# Altium schematic sheet Keypad Schematic.SchDoc: Keypad Schematic
size A4; Organization: Altium Limited; Address1: L3, 12a Rodborough Rd; Address2: Frenchs Forest; Address3: NSW; Address4: Australia 2086; DocumentNumber: 1; Revision: V1.0; SheetNumber: 1; SheetTotal: 1
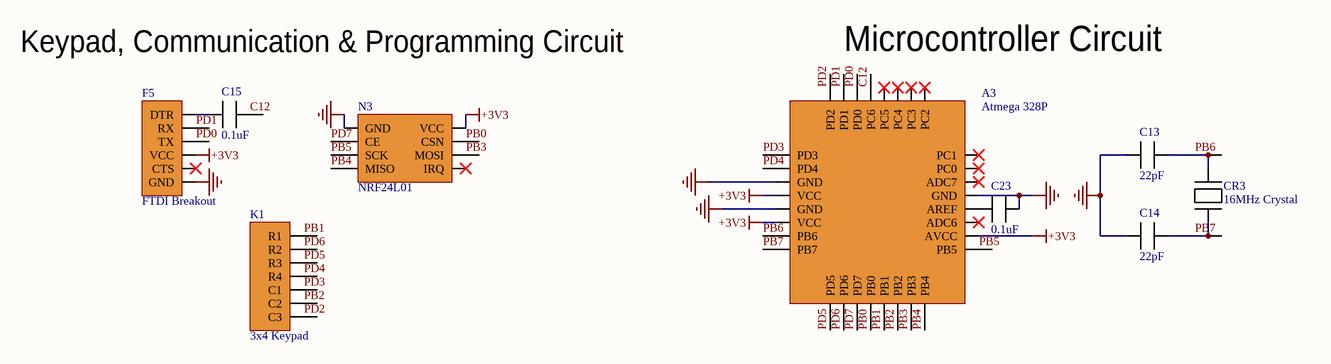
[diagram p0: Keypad Schematic.SchDoc]

## Parts
A3  Atmega 328P  [ATMega328P]
C13  22pF  [22pF Capacitor]
C14  22pF  [22pF Capacitor]
C15  0.1uF  [0.1uF Capacitor]
C23  0.1uF  [0.1uF Capacitor]
CR3  16MHz Crystal  [16MHz Crystal]
F5  FTDI Breakout  [FTDI]
K1  3x4 Keypad  [3x4 Keypad]
N3  NRF24L01  [NRF24L01]

## Nets
+3V3: A3.4(VCC) A3.6(VCC) A3.18(AVCC) F5.4(VCC) N3.5(VCC)
GND: A3.3(GND) A3.5(GND) A3.21(GND) C13.1 C14.1 C23.2 F5.6(GND) N3.1(GND)
C12: A3.29(PC6) C15.2
PB0: A3.12(PB0) N3.6(CSN)
PB1: A3.13(PB1) K1.1(R1)
PB2: A3.14(PB2) K1.6(C2)
PB3: A3.15(PB3) N3.7(MOSI)
PB4: A3.16(PB4) N3.4(MISO)
PB5: A3.17(PB5) N3.3(SCK)
PB6: A3.7(PB6) C13.2 CR3.2
PB7: A3.8(PB7) C14.2 CR3.1
PD0: A3.30(PD0) F5.3(TX)
PD1: A3.31(PD1) F5.2(RX)
PD2: A3.32(PD2) K1.7(C3)
PD3: A3.1(PD3) K1.5(C1)
PD4: A3.2(PD4) K1.4(R4)
PD5: A3.9(PD5) K1.3(R3)
PD6: A3.10(PD6) K1.2(R2)
PD7: A3.11(PD7) N3.2(CE)
NetA3_20: A3.20(AREF) C23.1
NetC15_1: C15.1 F5.1(DTR)

Not connected (* = marked no-connect by the designer): A3 19(ADC6)* 22(ADC7)* 23(PC0)* 24(PC1)* 25(PC2)* 26(PC3)* 27(PC4)* 28(PC5)*; F5 5(CTS)*; N3 8(IRQ)*

## Notes on the sheet
- Keypad, Communication & Programming Circuit
- (near A3) Microcontroller Circuit
- Title
- Size:
- Date:
- A4
- Number:
- Time:
- Revision:
- Sheet
- of
- File:

## Library data of the parts
A3 = ATMEGA328PB-AUR: IC MCU 8BIT 32KB FLASH 32TQFP; Manufacturer: Microchip; Interface: I2C,SPI,UART,USART; Peripherals: Brown-out Detect/Reset,POR,PWM,WDT; Core Architecture: AVR; Frequency: 20MHz; Number of I/Os: 27; Oscillator Type: Internal; Supplier 1: Digi-Key; Manufacturer Part Number: ATMEGA328PB-AUR; RoHS: No; Category: Microcontrollers; Stock 1: 9971; Pricing 1: 1=1.42000, 25=1.30000, 100=1.18000 (USD); Case/Package: TQFP; Number of Pins: 32; Min Operating Temperature: -40°C; Max Operating Temperature: 85°C; Memory Type: FLASH; Packaging: Tape and Reel; Memory Size: 32KB; ComponentLink1URL: http://www.microchip.com/mymicrochip/filehandler.aspx?ddocname=en589666&src-supplier=Digi-Key; ComponentLink1Description: http://www.microchip.com/mymicrochip/filehandler.aspx?ddocname=en589666&src-supplier=Digi-Key; Supplier Part Number 1: ATMEGA328PB-AURCT-ND
C13 C14 = 06035A220JAT2A: Cap Ceramic 22pF 50V C0G 5% SMD 0603 125C Paper T/R; Manufacturer: Kyocera AVX; Insulation Resistance: 100GR; Temperature Coefficient: 30ppm/°C; Supplier 1: Digi-Key; Manufacturer Part Number: 06035A220JAT2A; RoHS: Yes; Category: Ceramic Capacitors; Stock 1: 678111; Pricing 1: 1=0.10000, 10=0.05600, 50=0.03040, 100=0.02480, 500=0.01772, 1000=0.01392 (USD); Mount: Surface Mount,PCB; Case/Package: 0603; Number of Pins: 2; Case Code (Imperial): 0603; Case Code (Metric): 1608; Contact Plating: Tin,Matte; Dielectric Material: Ceramic; Min Operating Temperature: -55°C; Max Operating Temperature: 125°C; Tolerance: 5%; Capacitance: 22pF; Voltage Rating (DC): 50V; Packaging: Tape and Reel; Dielectric: C0G; Voltage: 50V; Voltage Rating: 50V; Package Quantity: 1; Termination: SMD/SMT; Length: 1.6mm; Width: 0.81mm; Height: 0.63mm; Thickness: 0.035inch; Depth: 0.81mm; Radiation Hardening: No; REACH SVHC: No SVHC; Lead Free: Lead Free; ComponentLink1URL: https://datasheet.ciiva.com/11788/0900766b802d4697-11788031.pdf?src-supplier=RSComponents; ComponentLink1Description: https://datasheet.ciiva.com/11788/0900766b802d4697-11788031.pdf?src-supplier=RSComponents; ComponentLink2URL: https://datasheet.ciiva.com/16351/ccog-16351125.pdf?src-supplier=Future+Electronics; ComponentLink2Description: https://datasheet.ciiva.com/16351/ccog-16351125.pdf?src-supplier=Future+Electronics; ComponentLink3URL: https://datasheet.ciiva.com/1124/759117-1124728.pdf?src-supplier=Element14; ComponentLink3Description: https://datasheet.ciiva.com/1124/759117-1124728.pdf?src-supplier=Element14; ComponentLink4URL: https://datasheet.ciiva.com/7855/759117-7855064.pdf?src-supplier=Element14; ComponentLink4Description: https://datasheet.ciiva.com/7855/759117-7855064.pdf?src-supplier=Element14; ComponentLink5URL: https://datasheet.ciiva.com/150/ccog-150366.pdf?src-supplier=Digi-Key; ComponentLink5Description: https://datasheet.ciiva.com/150/ccog-150366.pdf?src-supplier=Digi-Key; ComponentLink6URL: https://datasheet.ciiva.com/150/ccog-150367.pdf?src-supplier=Digi-Key; ComponentLink6Description: https://datasheet.ciiva.com/150/ccog-150367.pdf?src-supplier=Digi-Key; Supplier Part Number 1: 478-1167-1-ND
C15 C23 = 06033C104KAT4A: CAP CER 0.1UF 25V X7R 0603; Manufacturer: Kyocera AVX; Capacitance: 100nF; Tolerance: 10%; Supplier 1: Digi-Key; Manufacturer Part Number: 06033C104KAT4A; RoHS: Yes; Category: Ceramic Capacitors; Stock 1: 6112957; Pricing 1: 1=0.10000, 10=0.04200, 50=0.02320, 100=0.01890, 500=0.01348, 1000=0.01059, 2500=0.00962, 5000=0.00886 (USD); Mount: Surface Mount; Case/Package: 0603; Number of Pins: 2; Case Code (Metric): 1608; Case Code (Imperial): 0603; Min Operating Temperature: -55°C; Max Operating Temperature: 125°C; Packaging: Tape and Reel; Voltage Rating (DC): 25V; Dielectric: X7R; Package Quantity: 1; Voltage Rating: 25V; Termination: SMD/SMT; Length: 1.6mm; Width: 0.032inch; Height: 0.9mm; Thickness: 0.035inch; Depth: 0.81mm; REACH SVHC: No SVHC; Lead Free: Lead Free; ComponentLink1URL: https://datasheet.ciiva.com/22619/1679506-22619862.pdf?src-supplier=Element14; ComponentLink1Description: https://datasheet.ciiva.com/22619/1679506-22619862.pdf?src-supplier=Element14; ComponentLink2URL: https://datasheet.ciiva.com/28613/1679506-28613035.pdf?src-supplier=Element14; ComponentLink2Description: https://datasheet.ciiva.com/28613/1679506-28613035.pdf?src-supplier=Element14; ComponentLink3URL: https://datasheet.ciiva.com/6277/cx7r-6277758.pdf?src-supplier=Digi-Key; ComponentLink3Description: https://datasheet.ciiva.com/6277/cx7r-6277758.pdf?src-supplier=Digi-Key; ComponentLink4URL: https://datasheet.ciiva.com/6277/cx7r-6277759.pdf?src-supplier=Digi-Key; ComponentLink4Description: https://datasheet.ciiva.com/6277/cx7r-6277759.pdf?src-supplier=Digi-Key; Supplier Part Number 1: 478-7018-1-ND
CR3 = ECS-160-20-3X-TR: CRYSTAL 16.0000MHZ 20PF SMD; Manufacturer: ECS International; Frequency Tolerance: 30ppm; ESR (Equivalent Series Resistance): 50R; Frequency Stability: 50ppm; Supplier 1: Digi-Key; Manufacturer Part Number: ECS-160-20-3X-TR; RoHS: Yes; Category: Crystals; Stock 1: 6685; Pricing 1: 1=0.35000, 10=0.28800, 50=0.25880, 100=0.23000, 500=0.21850, 1000=0.18400 (USD); Mount: Surface Mount; Min Operating Temperature: -10°C; Max Operating Temperature: 70°C; Package Quantity: 1; Frequency: 16MHz; Load Capacitance: 20pF; Packaging: Tape and Reel; Tolerance: 30ppm; Termination: SMD/SMT; Length: 0.276inch; Width: 0.161inch; Height: 0.091inch; Lead Free: Lead Free; ComponentLink1URL: https://datasheet.ciiva.com/852/csm-3x-852328.pdf?src-supplier=Digi-Key; ComponentLink1Description: https://datasheet.ciiva.com/852/csm-3x-852328.pdf?src-supplier=Digi-Key; ComponentLink2URL: https://datasheet.ciiva.com/852/csm-3x-852329.pdf?src-supplier=Digi-Key; ComponentLink2Description: https://datasheet.ciiva.com/852/csm-3x-852329.pdf?src-supplier=Digi-Key; ComponentLink3URL: https://datasheet.ciiva.com/852/csm-3x-852330.pdf?src-supplier=Digi-Key; ComponentLink3Description: https://datasheet.ciiva.com/852/csm-3x-852330.pdf?src-supplier=Digi-Key; Supplier Part Number 1: XC1776CT-ND
F5 = FTDI: FTDI USB to TTL serial converter module
K1 = 419: Membrane 3X4 Matrix Keypad + Extras - 3X4; Manufacturer: Adafruit Industries; Illumination Type: Non-Illuminated; Supplier 1: Digi-Key; Manufacturer Part Number: 419; RoHS: Yes; Category: Uncategorized; Stock 1: 257; Pricing 1: 1=3.95000 (USD); Mount: Panel,Front; Termination: Connector; ComponentLink1URL: https://media.digikey.com/pdf/Data%20Sheets/Adafruit%20PDFs/419_Web.pdf?src-supplier=Digi-Key; ComponentLink1Description: https://media.digikey.com/pdf/Data%20Sheets/Adafruit%20PDFs/419_Web.pdf?src-supplier=Digi-Key; Supplier Part Number 1: 1528-1136-ND
N3 = NRF24L01: 3.3V NRF24L01 WIRELESS RF MODULE